# Altium schematic sheet 06 Arduino UNO.SchDoc: <Project Name>
size A3; ApprovedBy: <Appr.>; Author: <Author>; CompanyName: Infineon Technologies AG; Engineer: <Rel.>; Organization: Infineon Technologies AG; Address1: IFAG DES S PS; Address2: Am Campeon 1-12  -  85579 Neubiberg  -  Germany; Address3: 85579 Neubiberg; Address4: Germany; Revision: <Rev.>; SheetNumber: 6; Release: RC00; PageSetup: Record=PageOptions|CenterHorizontal=True|CenterVertical=True|PrintScale=1.01|XCorrection=1.00|YCorrection=1.00|PrintKind=0|BorderSize=5000000|LeftOffset=0|BottomOffset=0|Orientation=2|PaperLength=1000|PaperWidth=1000|Scale=100|PaperSource=7|PrintQuality=-4|MediaType=1|DitherType=10|PaperKind=A3|PrintScaleMode=1; Doc_ConfidentialStatus: <Doc_ConfidentialStatus>; Doc_Preliminary: <Doc_Preliminary>
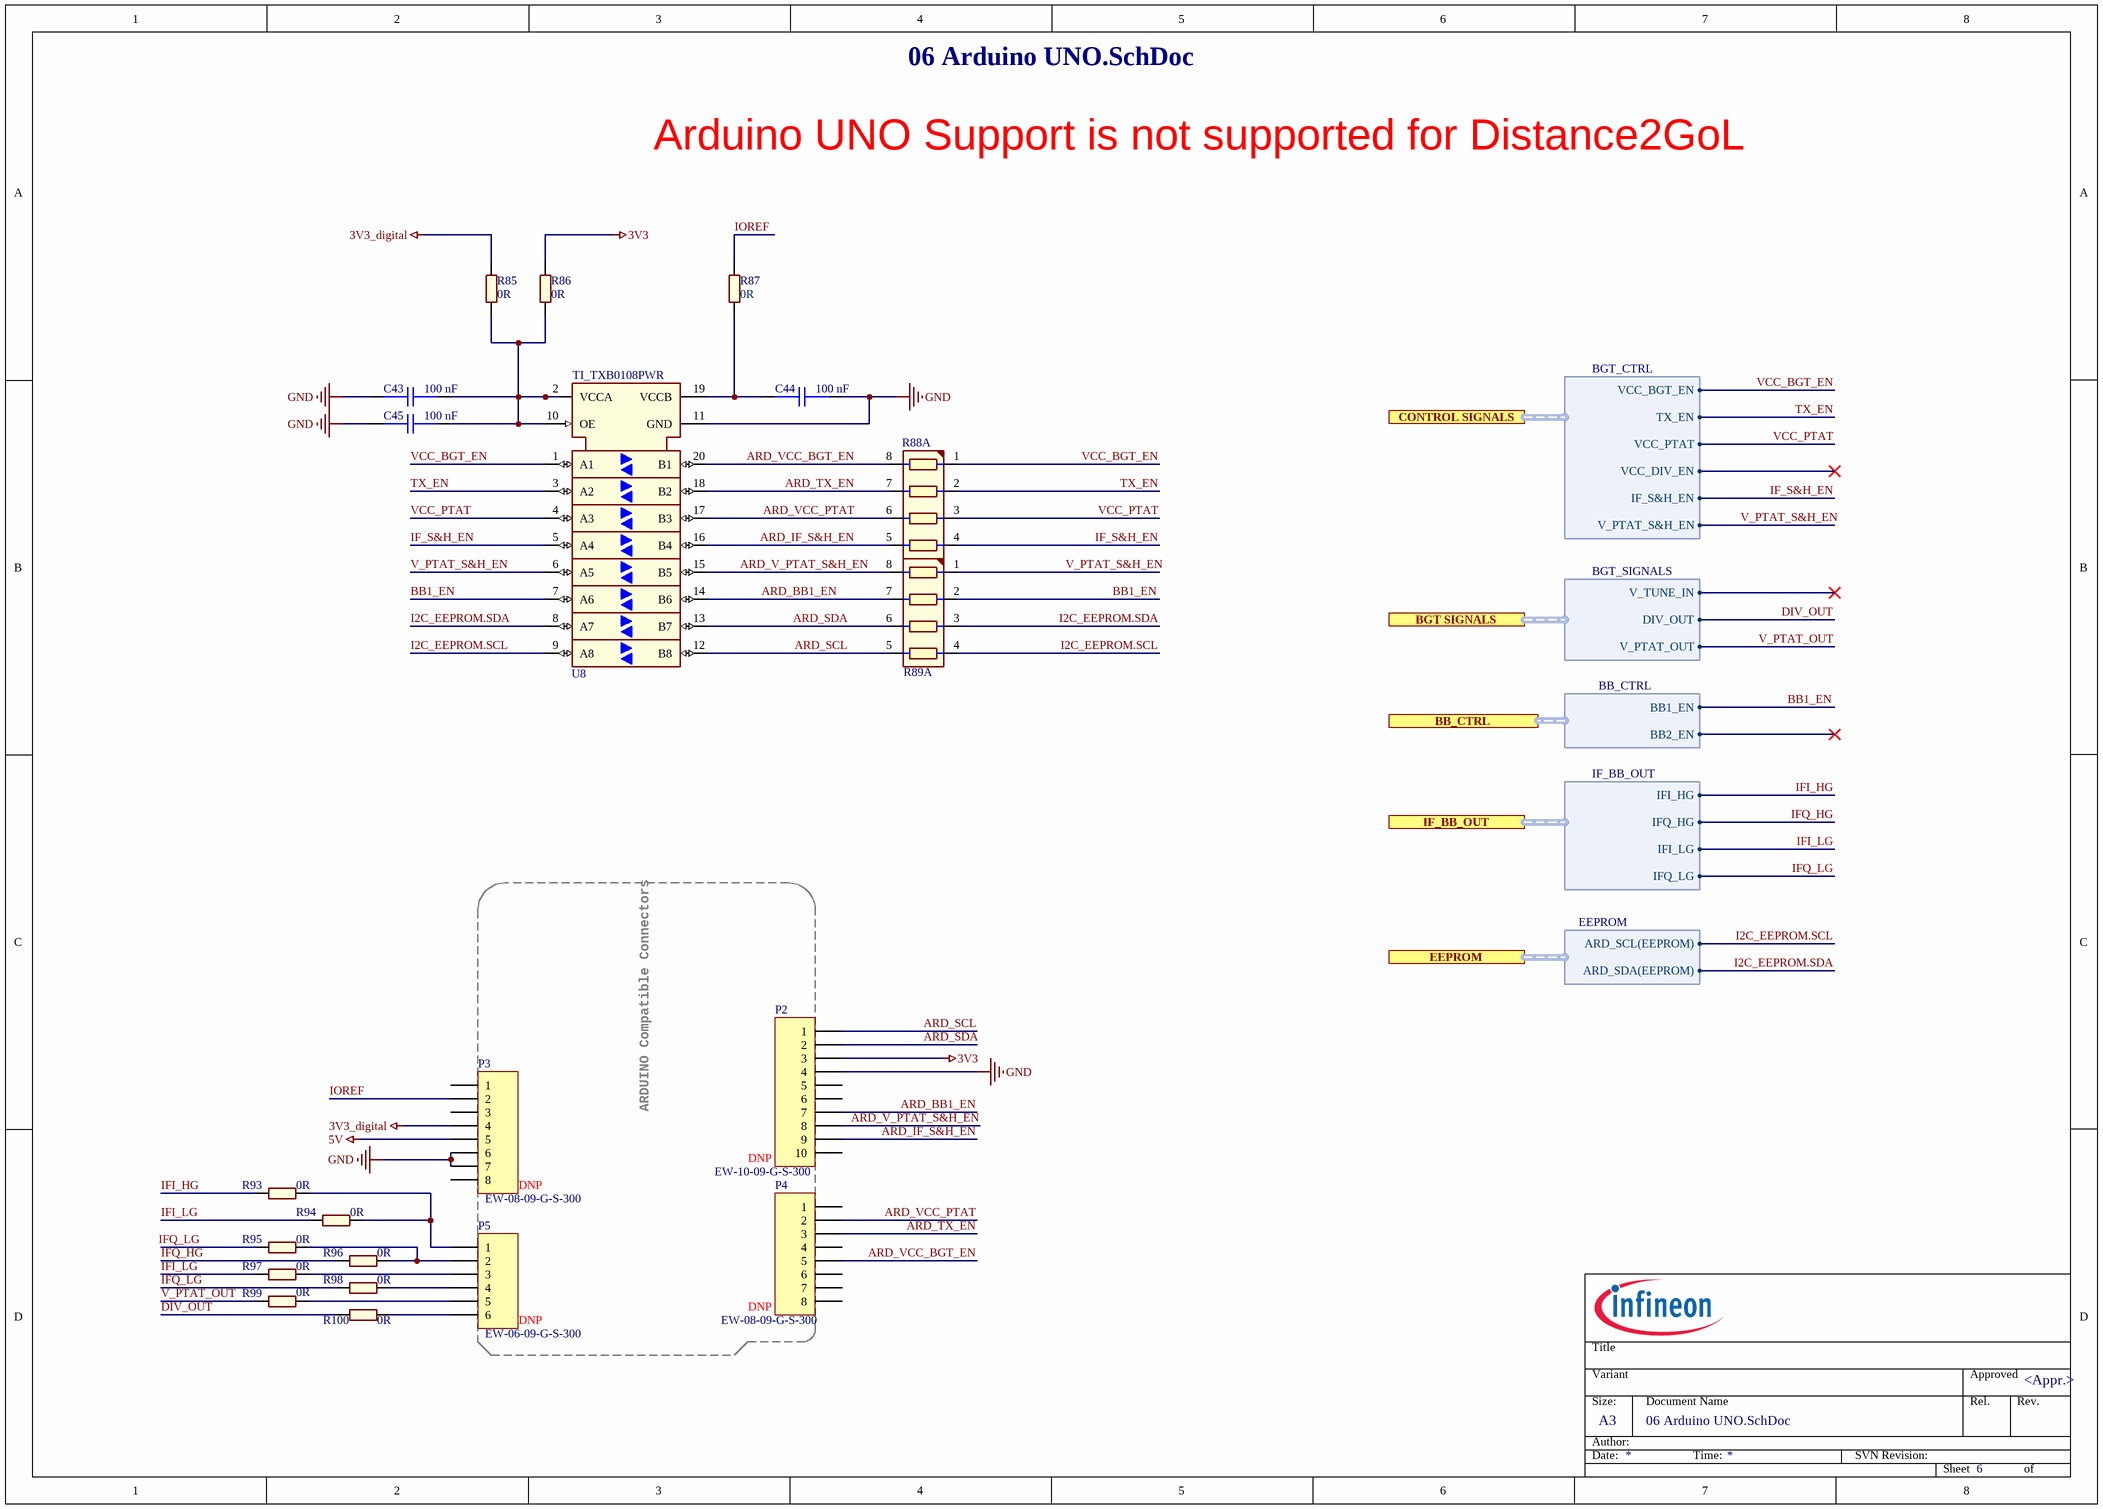
[diagram p0: 06 Arduino UNO.SchDoc]

## Parts
C43  100 nF  [CAPC1005X55N-0_2]
C44  100 nF  [CAPC1005X55N-0_2]
C45  100 nF  [CAPC1005X55N-0_2]
P2  DNP  Manufacturer Part Number: EW-10-09-G-S-300  [HDR1X10_Plug - DNP]
P3  DNP  Manufacturer Part Number: EW-08-09-G-S-300  [HDR1X8_Plug - DNP]
P4  DNP  Manufacturer Part Number: EW-08-09-G-S-300  [HDR1X8_Plug - DNP]
P5  DNP  Manufacturer Part Number: EW-06-09-G-S-300  [HDR1X6_Plug - DNP]
R85  0R  [RESC1005X40N_2]
R86  0R  [RESC1005X40N_2]
R87  0R  [RESC1005X40N_2]
R88  DNP  [RESCAX50P100X200X45-8N - DNP]  (value not drawn)  (part A of 4)
R89  DNP  [RESCAX50P100X200X45-8N - DNP]  (value not drawn)  (part A of 4)
R93  0R  [RESC1005X40N_2]
R94  0R  [RESC1005X40N_2]
R95  0R  [RESC1005X40N_2]
R96  0R  [RESC1005X40N_2]
R97  0R  [RESC1005X40N_2]
R98  0R  [RESC1005X40N_2]
R99  0R  [RESC1005X40N_2]
R100  0R  [RESC1005X40N_2]
U8  DNP  [SOP65P640X120-20N - DNP]  (value not drawn)

## Ports
BB_CTRL (harness BB_CTRL), BGT SIGNALS (harness BGT_SIGNALS), CONTROL SIGNALS (harness BGT_CTRL), EEPROM (harness EEPROM), IF_BB_OUT (harness IF_BB_OUT)

## Harnesses
EEPROM: ARD_SDA(EEPROM), ARD_SCL(EEPROM)
BGT_SIGNALS: V_TUNE_IN, DIV_OUT, V_PTAT_OUT
IF_BB_OUT: IFI_HG, IFQ_HG, IFQ_LG, IFI_LG
BGT_CTRL: VCC_BGT_EN, TX_EN, VCC_PTAT, VCC_DIV_EN, IF_S&H_EN, V_PTAT_S&H_EN
BB_CTRL: BB1_EN, BB2_EN

## Nets
3V3: P2.3 R86.2
3V3_digital: P3.4 R85.2
5V: P3.5
GND: C43.1 C44.2 C45.1 P2.4 P3.6 P3.7 U8.11(GND)
ARD_BB1_EN: P2.7 R89.7 U8.14(B6)
ARD_IF_S&H_EN: P2.9 R88.5 U8.16(B4)
ARD_SCL: P2.1 R89.5 U8.12(B8)
ARD_SDA: P2.2 R89.6 U8.13(B7)
ARD_TX_EN: P4.3 R88.7 U8.18(B2)
ARD_V_PTAT_S&H_EN: P2.8 R89.8 U8.15(B5)
ARD_VCC_BGT_EN: P4.5 R88.8 U8.20(B1)
ARD_VCC_PTAT: P4.2 R88.6 U8.17(B3)
BB1_EN: R89.2 U8.7(A6) ; port BB_CTRL.BB1_EN
DIV_OUT: R100.2 ; port BGT SIGNALS.DIV_OUT
I2C_EEPROM.SCL: R89.4 U8.9(A8) ; port EEPROM.ARD_SCL(EEPROM)
I2C_EEPROM.SDA: R89.3 U8.8(A7) ; port EEPROM.ARD_SDA(EEPROM)
IF_S&H_EN: R88.4 U8.5(A4) ; port CONTROL SIGNALS.IF_S&H_EN
IFI_HG: R93.2 ; port IF_BB_OUT.IFI_HG
IFI_LG: R94.2 R97.2 ; port IF_BB_OUT.IFI_LG
IFQ_HG: R96.2 ; port IF_BB_OUT.IFQ_HG
IFQ_LG: R95.2 R98.2 ; port IF_BB_OUT.IFQ_LG
IOREF: P3.2 R87.2
TX_EN: R88.2 U8.3(A2) ; port CONTROL SIGNALS.TX_EN
V_PTAT_OUT: R99.2 ; port BGT SIGNALS.V_PTAT_OUT
V_PTAT_S&H_EN: R89.1 U8.6(A5) ; port CONTROL SIGNALS.V_PTAT_S&H_EN
VCC_BGT_EN: R88.1 U8.1(A1) ; port CONTROL SIGNALS.VCC_BGT_EN
VCC_PTAT: R88.3 U8.4(A3) ; port CONTROL SIGNALS.VCC_PTAT
NetC43_2: C43.2 C45.2 R85.1 R86.1 U8.2(VCCA) U8.10(OE)
NetC44_1: C44.1 R87.1 U8.19(VCCB)
NetP5_1: P5.1 R93.1 R94.1
NetP5_2: P5.2 R95.1 R96.1
NetP5_3: P5.3 R97.1
NetP5_4: P5.4 R98.1
NetP5_5: P5.5 R99.1
NetP5_6: P5.6 R100.1

Not connected (* = marked no-connect by the designer): P2 5 6 10; P3 1 3 8; P4 1 4 6 7 8

## Notes on the sheet
- Arduino UNO Support is not supported for Distance2GoL
- ARDUINO Compatible Connectors
- Title
- Variant
- Approved
- Date:
- Author:
- Size:
- A3
- Document Name
- Time:
- SVN Revision:
- Rel.
- Rev.
- Sheet
- of

## Library data of the parts
C43-C45 = CAP01010597: General Purpose Surface Mount Ceramic Capacitor; Manufacturer: muRata; PartRelease: new; Manufacturer Component Status: Active; ComponentStatus: Released; Voltage: 16Vdc; Tolerance: 2%; TemperaturCharacteristic: C0G; AutomotiveQualified: no; ColibryArticleNumber: 308039; PartNumber: CAP01010597; Value: 100 nF; Type: 100 nF; PackageReference: 0402; PackageDescription: Capacitor,non-polarized,Chip;1.00mm L X 0.50mm W X 0.55mm H; ComponentHeight: 0.55mm; PartType: General Purpose Surface Mount Ceramic Capacitor; ComponentLink1Description: Vendor WebSite; ComponentLink1URL: http://www.murata.com; ComponentLink2Description: Datasheet; ComponentLink2URL: \\MUCSDN31.eu.infineon.com\PCB_Library_Datasheets\GRM1555C1H101GA01.pdf; FixedSupplier: Yes; PartProvision: No; Supplier 1: Farnell; Supplier 2: Digi-Key; Supplier 3: Mouser
P2 = Header 10: Header, 10-Pin, 10mm Height, EW-10-09-G-S-300; Manufacturer: Samtec; LatestRevisionDate: 17-Jul-2002; LatestRevisionNote: Re-released for DXP Platform.; Publisher: Altium Limited
P3 P4 = Header 8: Header, 8-Pin 10mm Height, EW-08-09-G-S-300; Manufacturer: Samtec; LatestRevisionDate: 17-Jul-2002; LatestRevisionNote: Re-released for DXP Platform.; Publisher: Altium Limited
P5 = Header 6: Header, 6-Pin, 10mm Height, EW-06-09-G-S-300; Manufacturer: Samtec; LatestRevisionDate: 17-Jul-2002; LatestRevisionNote: Re-released for DXP Platform.; Publisher: Altium Limited
R85-R87 R93-R100 = RES01800000: 0R/50V/20mOhm; Manufacturer: Vishay; ManufacturerPartNumber: CRCW04020000Z0ED; PartProvision: no; PartRelease: new; Manufacturer Component Status: Active; Symbol Type: Standard Resistor Symbol; Alternate View: yes; ComponentStatus: Released; Power: 1.5A; Voltage: 50V; Tolerance: 20mOhm; AutomotiveQualified: AEC-Q200; ColibryArticleNumber: 339877; PartNumber: RES01800000; PackageReference: 0402; Value: 0R; Type: 0R/50V/20mOhm; PartType: Thick Film Chip Resistor; ComponentHeight: 0.4mm; TK: -; ComponentLink1Description: Vendor WebSite; ComponentLink1URL: http://www.vishay.com/; ComponentLink2Description: Datasheet; ComponentLink2URL: \\MUCSDN31.eu.infineon.com\PCB_Library_Datasheets\dcrcwe3.pdf; FixedSupplier: no
R88 R89 = RES-ARY-STD-08P_00000029: Thick Film Chip Resistor Array; Manufacturer: Panasonic; Manufacturer Order Number: EXB-28V102JX; Manufacturer Component Status: Active; Symbol Type: Resistor; Array; Standard; 8 Pins; Alternate View: Yes; Article Number: 489759; Version Number: V01; Tolerance Neg: 5%; Combined Parameters: TCR:200ppm/K;Tol.:-5%/+5%;Vdc:50V;Idc:-;P:63mW; Automotive Qualified: AEC Q200; Voltage DC (max): 50V; Multible Parts: Yes; Part Type: Resistor; Value: DNP; Tolerance Pos: 5%; Type: Standard; Application: Standard; Style: Array; Technology: Thick Film; Temperature min: -55; Temperature max: 125; Temperature Range: Military; RoHS Compliant: Y; PackageReference: 0402; ComponentLink1Description: Vendor WebSite; ComponentLink1URL: http://panasonic.net/sanyo/index.html; ComponentLink2Description: Datasheet; ComponentLink2URL: http://webnetprod.muc.infineon.com/pcbportal_prod/WorkFlows/AltiumComponent/StandardDocumentation?Versionid=489760; Supplier 1: Farnell; Supplier Part Number 1: 2692859; Supplier 2: DigiKey; Supplier Part Number 2: Y7102TR-ND; Supplier 3: Mouser; Supplier Part Number 3: 667-EXB-28V102JX; PLMStatus: Active; Second Source allowed: Yes; Package Description: Resistor,Chip Array,0.50mm pitch;8 pin,1.00mm W X 2.00mm L X 0.45mm H
U8 = IC02600537: TI_TXB0108PWR; Manufacturer: Texas Instruments; PartRelease: new; Manufacturer Component Status: Active; Symbol Type: 8-Bit Bidirectional Voltage-Level Translator with Auto-Direction Sensing and ±15-kV ESD Protection; ComponentStatus: Released; AutomotiveQualified: no; ColibryArticleNumber: 408700; PartNumber: IC02600537; ComponentName: TI_TXB0108PWR; Type: TXB0108PWR; ComponentHeight: 1.2mm; ManufacturerPartNumber: TXB0108PWR; PackageDescription: SOP,0.65mm pitch;20 pin,4.40mm W X 6.50mm L X 1.20mm H body; PackageReference: TSSOP-20 (PW); ComponentLink1Description: Vendor WebSite; ComponentLink1URL: http://www.ti.com; ComponentLink2Description: Datasheet; ComponentLink2URL: \\MUCSDN31.eu.infineon.com\PCB_Library_Datasheets\TXB0108.pdf; FixedSupplier: yes; PartProvision: no; Supplier 1: Farnell; Supplier Part Number 1: 2437914; Supplier 2: Digi-Key; Supplier Part Number 2: 296-21527-2-ND; Supplier 3: Mouser; Supplier Part Number 3: 595-TXB0108PWR